# Altium project Transceiver_Project.PrjPCB
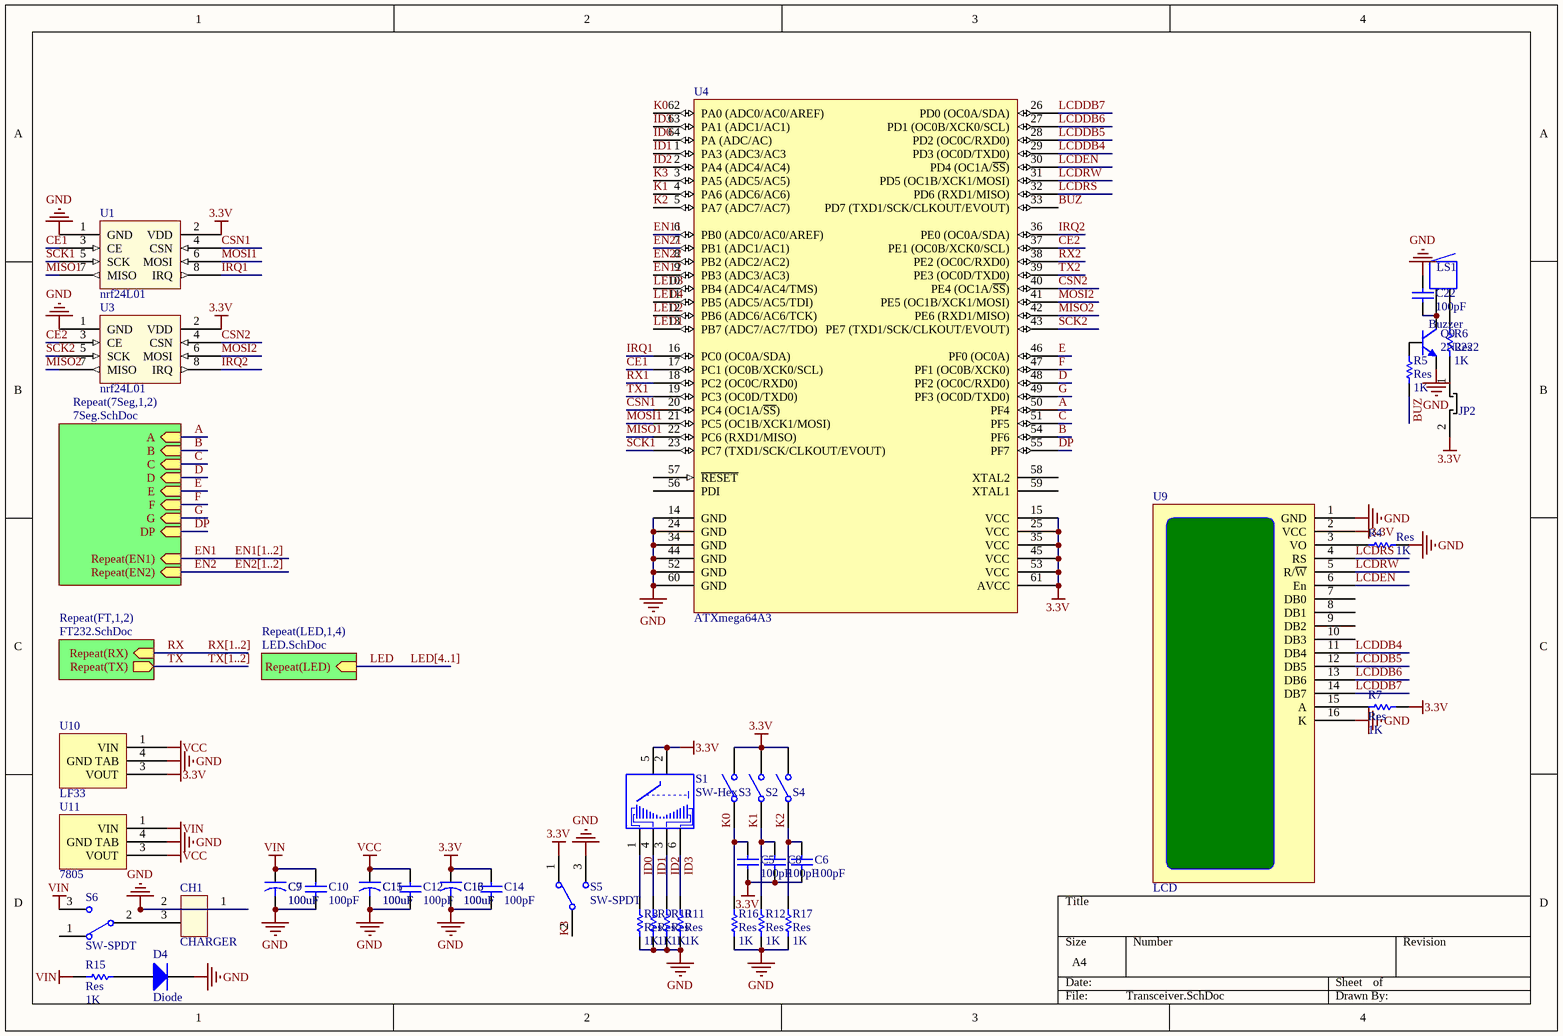
[diagram p0: Transceiver.SchDoc]
3 sheets, 74 parts. Net scope: hierarchical (ports join the sheet entries above them; power ports are global).
Board file: Transceiver.PcbDoc
Sheets:
  Transceiver.SchDoc
    FT1 = FT232.SchDoc
    FT2 = FT232.SchDoc
    7Seg1 = 7Seg.SchDoc
    7Seg2 = 7Seg.SchDoc

## Sheet Transceiver.SchDoc
size A4

### Parts
C5  value 100pF  [2012[0805]]  (hidden comment: Cap_UP)
C6  value 100pF  [2012[0805]]  (hidden comment: Cap_UP)
C7  value 100uF  [EL_M]  (hidden comment: Cap_El)
C8  value 100pF  [2012[0805]]  (hidden comment: Cap_UP)
C9  value 100uF  [EL_M]  (hidden comment: Cap_El)
C10  value 100pF  [2012[0805]]  (hidden comment: Cap_UP)
C11  value 100uF  [EL_M]  (hidden comment: Cap_El)
C12  value 100pF  [2012[0805]]  (hidden comment: Cap_UP)
C13  value 100uF  [EL_M]  (hidden comment: Cap_El)
C14  value 100pF  [2012[0805]]  (hidden comment: Cap_UP)
C15  value 100uF  [EL_M]  (hidden comment: Cap_El)
C16  value 100uF  [EL_M]  (hidden comment: Cap_El)
C22  value 100pF  [2012[0805]]  (hidden comment: Cap_UP)
CH1  CHARGER  [CHARGER]
D4  Diode  [2012[0805]]
JP2  JUMPER  [HDR1X2]  (value not drawn)
LS1  Buzzer  [BUZZER]
Q9  2N2222  [SOT-23]
R4  Res  value 1K  [2012[0805]]
R5  Res  value 1K  [2012[0805]]
R6  Res  value 1K  [2012[0805]]
R7  Res  value 1K  [2012[0805]]
R8  Res  value 1K  [2012[0805]]
R9  Res  value 1K  [2012[0805]]
R10  Res  value 1K  [2012[0805]]
R11  Res  value 1K  [2012[0805]]
R12  Res  value 1K  [2012[0805]]
R15  Res  value 1K  [2012[0805]]
R16  Res  value 1K  [2012[0805]]
R17  Res  value 1K  [2012[0805]]
S1  SW-Hex  [SW-HEX]
S2  SW-SPST  [PUSH-BUT-SMD]  (value not drawn)
S3  SW-SPST  [PUSH-BUT]  (value not drawn)
S4  SW-SPST  [PUSH-BUT]  (value not drawn)
S5  SW-SPDT  [SW-SPDT]
S6  SW-SPDT  [SW-SPDT]
U1  nrf24L01  [NRF24L01+PA+LNA]
U3  nrf24L01  [NRF24L01+PA+LNA]
U4  ATXmega64A3  [64A_N]
U9  LCD  [LCD]
U10  LF33  [D-PACK]
U11  7805  [D-PACK]

### Sub-sheets
Repeat(7Seg,1,2) = 7Seg.SchDoc: A (in), B (in), C (in), D (in), E (in), F (in), G (in), DP (in), Repeat(EN1) (in), Repeat(EN2) (in)
Repeat(FT,1,2) = FT232.SchDoc: Repeat(RX) (in), Repeat(TX) (out)
Repeat(LED,1,4) = LED.SchDoc (file not in this document): Repeat(LED) (in)

### Nets
3.3V: C5.2 C6.2 C8.2 C13.1 C14.2 C16.1 JP2.2 R7.2 S1.2 S1.5 S2.2(NO) S3.2(NO) S4.2(NO) S5.1 U1.2(VDD) U3.2(VDD) U4.15(VCC) U4.25(VCC) U4.35(VCC) U4.45(VCC) U4.53(VCC) U4.61(AVCC) U9.2(VCC) U10.3(VOUT)
GND: C7.2 C9.2 C10.1 C11.2 C12.1 C13.2 C14.1 C15.2 C16.2 C22.2 CH1.1 CH1.2 D4.2(K) Q9.3(E) R4.2 R8.1 R9.1 R10.1 R11.1 R12.1 R16.1 R17.1 S5.3 U1.1(GND) U3.1(GND) U4.14(GND) U4.24(GND) U4.34(GND) U4.44(GND) U4.52(GND) U4.60(GND) U9.1(GND) U9.16(K) U10.4(GND_TAB) U11.4(GND_TAB)
VCC: C11.1 C12.2 C15.1 U10.1(VIN) U11.3(VOUT)
VIN: C7.1 C9.1 C10.2 R15.1 S6.3 U11.1(VIN)
A: U4.50(PF4) ; sheet Repeat(7Seg,1,2)/A
B: U4.54(PF6) ; sheet Repeat(7Seg,1,2)/B
BUZ: R5.2 U4.33(PD7_(TXD1/SCK/CLKOUT/EVOUT))
C: U4.51(PF5) ; sheet Repeat(7Seg,1,2)/C
CE1: U1.3(CE) U4.17(PC1_(OC0B/XCK0/SCL))
CE2: U3.3(CE) U4.37(PE1_(OC0B/XCK0/SCL))
CSN1: U1.4(CSN) U4.20(PC4_(OC1A/~{SS}))
CSN2: U3.4(CSN) U4.40(PE4_(OC1A/~{SS}))
D: U4.48(PF2_(OC0C/RXD0)) ; sheet Repeat(7Seg,1,2)/D
DP: U4.55(PF7) ; sheet Repeat(7Seg,1,2)/DP
E: U4.46(PF0_(OC0A)) ; sheet Repeat(7Seg,1,2)/E
EN1: sheet Repeat(7Seg,1,2)/Repeat(EN1)
EN2: sheet Repeat(7Seg,1,2)/Repeat(EN2)
EN11: U4.6(PB0_(ADC0/AC0/AREF))  [project net EN1]
EN12: U4.9(PB3_(ADC3/AC3))  [project net EN1]
EN21: U4.7(PB1_(ADC1/AC1))  [project net EN2]
EN22: U4.8(PB2_(ADC2/AC2))  [project net EN2]
F: U4.47(PF1_(OC0B/XCK0)) ; sheet Repeat(7Seg,1,2)/F
G: U4.49(PF3_(OC0D/TXD0)) ; sheet Repeat(7Seg,1,2)/G
ID0: R8.2 S1.1 U4.64(PA_(ADC/AC))
ID1: R9.2 S1.4 U4.1(PA3_(ADC3/AC3)
ID2: R10.2 S1.3 U4.2(PA4_(ADC4/AC4))
ID3: R11.2 S1.6 U4.63(PA1_(ADC1/AC1))
IRQ1: U1.8(IRQ) U4.16(PC0_(OC0A/SDA))
IRQ2: U3.8(IRQ) U4.36(PE0_(OC0A/SDA))
K0: C5.1 R16.2 S3.1(COMMON) U4.62(PA0_(ADC0/AC0/AREF))
K1: C8.1 R12.2 S2.1(COMMON) U4.4(PA6_(ADC6/AC6))
K2: C6.1 R17.2 S4.1(COMMON) U4.5(PA7_(ADC7/AC7))
K3: S5.2 U4.3(PA5_(ADC5/AC5))
LCDDB4: U4.29(PD3_(OC0D/TXD0)) U9.11(DB4)
LCDDB5: U4.28(PD2_(OC0C/RXD0)) U9.12(DB5)
LCDDB6: U4.27(PD1_(OC0B/XCK0/SCL)) U9.13(DB6)
LCDDB7: U4.26(PD0_(OC0A/SDA)) U9.14(DB7)
LCDEN: U4.30(PD4_(OC1A/~{SS})) U9.6(En)
LCDRS: U4.32(PD6_(RXD1/MISO)) U9.4(RS)
LCDRW: U4.31(PD5_(OC1B/XCK1/MOSI)) U9.5(R/~{W})
LED: sheet Repeat(LED,1,4)/Repeat(LED)
LED1: U4.13(PB7_(ADC7/AC7/TDO))
LED2: U4.12(PB6_(ADC6/AC6/TCK))
LED3: U4.10(PB4_(ADC4/AC4/TMS))
LED4: U4.11(PB5_(ADC5/AC5/TDI))
MISO1: U1.7(MISO) U4.22(PC6_(RXD1/MISO))
MISO2: U3.7(MISO) U4.42(PE6_(RXD1/MISO))
MOSI1: U1.6(MOSI) U4.21(PC5_(OC1B/XCK1/MOSI))
MOSI2: U3.6(MOSI) U4.41(PE5_(OC1B/XCK1/MOSI))
RX: sheet Repeat(FT,1,2)/Repeat(RX)
RX1: U4.18(PC2_(OC0C/RXD0))
RX2: U4.38(PE2_(OC0C/RXD0))
SCK1: U1.5(SCK) U4.23(PC7_(TXD1/SCK/CLKOUT/EVOUT))
SCK2: U3.5(SCK) U4.43(PE7_(TXD1/SCK/CLKOUT/EVOUT))
TX: sheet Repeat(FT,1,2)/Repeat(TX)
TX1: U4.19(PC3_(OC0D/TXD0))
TX2: U4.39(PE3_(OC0D/TXD0))
NetC22_1: C22.1 LS1.1 Q9.1(C)
NetCH1_3: CH1.3 S6.2
NetD4_1: D4.1(A) R15.2
NetJP2_1: JP2.1 R6.2
NetLS1_2: LS1.2 R6.1
NetQ9_2: Q9.2(B) R5.1
NetR4_1: R4.1 U9.3(VO)
NetR7_1: R7.1 U9.15(A)

Not connected (* = marked no-connect by the designer): S6 1(3); U4 56(PDI) 57(~{RESET}) 58(XTAL2) 59(XTAL1); U9 7(DB0) 8(DB1) 9(DB2) 10(DB3)

### Buses and harness runs
bus EN1[1..2]
bus EN2[1..2]
bus LED[4..1]
bus RX[1..2]
bus TX[1..2]

### Library data of the parts
C5 C6 C8 C10 C12 C14 C22 = Cap_UP: Capacitor; Published: 8-Jun-2000; LatestRevisionDate: 17-Jul-2002; LatestRevisionNote: Re-released for DXP Platform.; PackageReference: RAD-0.3; Publisher: Altium Limited
C7 C9 C11 C13 C15 C16 = Cap_El: Capacitor; Published: 23-Sep-2002; PackageReference: CAPR5-4X5; Publisher: Altium Limited
D4 = Diode: 1 Amp General Purpose Rectifier; Revision 1: 11-Jul-2000: SIM Model Added.; Revision 2: 17-Jul-2002: Re-released for DXP Platform.; Package Information: Latest Revision: Aug-1999; Code - JEDEC: DO-204-AL; Published: 8-Jun-2000; Datasheet: Latest Revision: 1998; Package Reference: DO-41; Publisher: Altium Limited
LS1 = Buzzer: Magnetic Transducer Buzzer; Published: 24-Mar-1999; LatestRevisionDate: 17-Dec-2003; LatestRevisionNote: Schematic revised, PCB Footprint replaced.; DatasheetDocument: 17-Dec-2003; PackageReference: ABSM-1574; Publisher: Altium Limited; ComponentLink1Description: Manufacturer Link; ComponentLink1URL: http://www.megastar.com/linecard/buzzmode/index.php
Q9 = 2N2222: NPN Bipolar Transistor; Published: 8-Jun-2000; LatestRevisionDate: 17-Jul-2002; LatestRevisionNote: Re-released for DXP Platform.; PackageReference: TO-226; Publisher: Altium Limited; Code_JEDEC: TO-226-AA
R4-R12 R15-R17 = Res: Semiconductor Resistor; Published: 8-Jun-2000; LatestRevisionDate: 17-Jul-2002; LatestRevisionNote: Re-released for DXP Platform.; PackageReference: AXIAL-0.5; Publisher: Altium Limited
S2-S4 = SW-SPST: Single-Pole, Single-Throw Switch; Published: 24-Mar-1999; Revision: July-2002: Re-released for DXP Platform.; Publisher: Altium Limited
S5 S6 = SW-SPDT: SPDT Subminiature Toggle Switch, Right Angle Mounting, Vertical Actuation; Published: 24-Mar-1999; LatestRevisionDate: 17-Dec-2003; LatestRevisionNote: Schematic revised, PCB Footprint replaced.; DatasheetDocument: 05-Dec-2000; PackageReference: TL36WW15050; Publisher: Altium Limited; ComponentLink1Description: Manufacturer Link; ComponentLink1URL: http://www.apem.com
U9 = LCD: LCD 2X16
U10 = 7805
S1 = SW-Hex: Published: 24-Mar-1999; LatestRevisionDate: 17-Jul-2002; LatestRevisionNote: Re-released for DXP Platform.; PackageReference: DIP-8; Publisher: Altium Limited

## Sheet FT232.SchDoc
size A4
Used 2 times, as channels FT1, FT2. Parts and nets are listed once, with the designators drawn on the sheet.
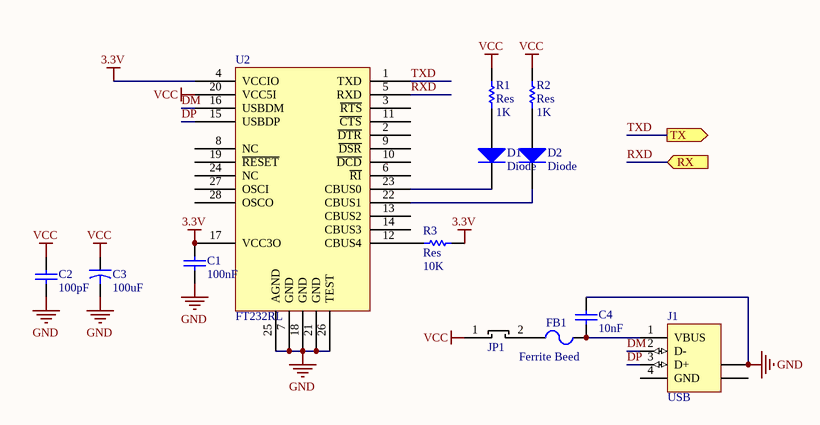
[diagram p1: FT232.SchDoc]

### Parts
C1  value 100nF  [2012[0805]]  (hidden comment: Cap_UP)
C2  value 100pF  [2012[0805]]  (hidden comment: Cap_UP)
C3  value 100uF  [2012[0805]]  (hidden comment: Cap_El)
C4  value 10nF  [2012[0805]]  (hidden comment: Cap_UP)
D1  Diode  [2012[0805]]
D2  Diode  [2012[0805]]
FB1  Ferrite Beed  [2012[0805]]
J1  USB  [USB_MINI]
JP1  JUMPER  [HDR1X2]  (value not drawn)
R1  Res  value 1K  [2012[0805]]
R2  Res  value 1K  [2012[0805]]
R3  Res  value 10K  [2012[0805]]
U2  FT232RL  [SSOP28]

### Ports
RX (in), TX (out)

### Nets
3.3V: C1.2 R3.2 U2.4(VCCIO) U2.17(VCC3O)
GND: C1.1 C2.1 C3.2 C4.1 J1.5(SHLD) U2.7(GND) U2.18(GND) U2.21(GND) U2.25(AGND) U2.26(TEST)
VCC: C2.2 C3.1 JP1.1 R1.2 R2.2 U2.20(VCC5I)
DM: J1.2(D-) U2.16(USBDM)
DP: J1.3(D+) U2.15(USBDP)
RXD: U2.5(RXD) ; port RX
TXD: U2.1(TXD) ; port TX
NetC4_2: C4.2 FB1.2 J1.1(VBUS)
NetD1_1: D1.1(A) R1.1
NetD1_2: D1.2(K) U2.23(CBUS0)
NetD2_1: D2.1(A) R2.1
NetD2_2: D2.2(K) U2.22(CBUS1)
NetFB1_1: FB1.1 JP1.2
NetR3_1: R3.1 U2.12(CBUS4)

Not connected (* = marked no-connect by the designer): J1 4(GND) 6(SHLD); U2 2(~{DTR}) 3(~{RTS}) 6(~{RI}) 8(NC) 9(~{DSR}) 10(~{DCD}) 11(~{CTS}) 13(CBUS2) 14(CBUS3) 19(~{RESET}) 24(NC) 27(OSCI) 28(OSCO)

### Channels
FT1: designators end in _FT1; ports RX=RX1 TX=TX1
FT2: designators end in _FT2; ports RX=RX2 TX=TX2

### Library data of the parts
C1 C2 C4 = Cap_UP: Capacitor; Published: 8-Jun-2000; LatestRevisionDate: 17-Jul-2002; LatestRevisionNote: Re-released for DXP Platform.; PackageReference: RAD-0.3; Publisher: Altium Limited
C3 = Cap_El: Capacitor; Published: 23-Sep-2002; PackageReference: CAPR5-4X5; Publisher: Altium Limited
D1 D2 = Diode: as D4 on sheet Transceiver; Published: 8-Jun-2000; Datasheet: Latest Revision: 1998; Package Reference: DO-41; Publisher: Altium Limited
FB1 = Ferrite Beed: Code_IEC: 1005; Published: 8-Jun-2000; LatestRevisionDate: 17-Jul-2002; LatestRevisionNote: Re-released for DXP Platform.; PackageReference: 0402-A; Publisher: Altium Limited; Code_JEITA: 0402
J1 = USB: USB 1.1, Right Angle, Thru-Hole, A Type, Receptacle, 4 Position, Black; ContactMaterial: Copper Alloy; ContactPlating: Gold (30) over Palladium Nickel; TerminationLength: 2.84mm [0.112in.]; PCB_Layout: Complies with manufacturer's recommendation.; DrillSize: Corresponds to nominal value.; PanelGround: Without; Published: 15-Jul-2004; DatasheetDocument: 11-Jan-2004; PackageDocument: 11-Jan-2004; PackageReference: 1364372; Publisher: Altium Limited; HousingMaterial: Thermoplastic; ComponentLink1Description: Manufacturer Link; ComponentLink1URL: http://www.tycoelectronics.com/; ComponentLink2Description: Packaging Specification; ComponentLink2URL: http://ecommas.tycoelectronics.com/commerce/DocumentDelivery/DDEController?Action=showdoc&DocId=Customer+Drawing%7F1364372%7FD%7Ftif%7FEnglish%7FENG_CD_1364372_D.tif
R1-R3 = Res: Semiconductor Resistor; Published: 8-Jun-2000; LatestRevisionDate: 17-Jul-2002; LatestRevisionNote: Re-released for DXP Platform.; PackageReference: AXIAL-0.5; Publisher: Altium Limited

## Sheet 7Seg.SchDoc
size A4
Used 2 times, as channels 7Seg1, 7Seg2. Parts and nets are listed once, with the designators drawn on the sheet.
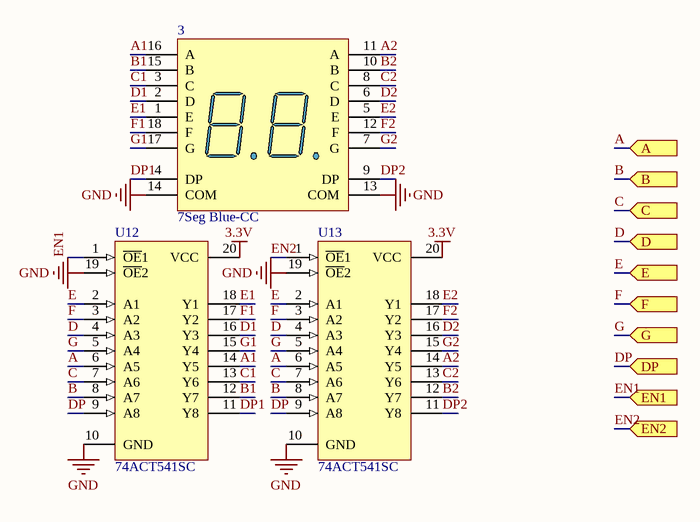
[diagram p2: 7Seg.SchDoc]

### Parts
3  7Seg Blue-CC  [7Segment Dual]
U12  74ACT541SC  [M20B_N]
U13  74ACT541SC  [M20B_N]

### Ports
A (in), B (in), C (in), D (in), DP (in), E (in), EN1 (in), EN2 (in), F (in), G (in)

### Nets
3.3V: U12.20(VCC) U13.20(VCC)
GND: 3.13(COM) 3.14(COM) U12.10(GND) U12.19(~{OE}2) U13.10(GND) U13.19(~{OE}2)
A: U12.6(A5) U13.6(A5) ; port A
A1: 3.16(A) U12.14(Y5)
A2: 3.11(A) U13.14(Y5)
B: U12.8(A7) U13.8(A7) ; port B
B1: 3.15(B) U12.12(Y7)
B2: 3.10(B) U13.12(Y7)
C: U12.7(A6) U13.7(A6) ; port C
C1: 3.3(C) U12.13(Y6)
C2: 3.8(C) U13.13(Y6)
D: U12.4(A3) U13.4(A3) ; port D
D1: 3.2(D) U12.16(Y3)
D2: 3.6(D) U13.16(Y3)
DP: U12.9(A8) U13.9(A8) ; port DP
DP1: 3.4(DP) U12.11(Y8)
DP2: 3.9(DP) U13.11(Y8)
E: U12.2(A1) U13.2(A1) ; port E
E1: 3.1(E) U12.18(Y1)
E2: 3.5(E) U13.18(Y1)
EN1: U12.1(~{OE}1) ; port EN1
EN2: U13.1(~{OE}1) ; port EN2
F: U12.3(A2) U13.3(A2) ; port F
F1: 3.18(F) U12.17(Y2)
F2: 3.12(F) U13.17(Y2)
G: U12.5(A4) U13.5(A4) ; port G
G1: 3.17(G) U12.15(Y4)
G2: 3.7(G) U13.15(Y4)

### Channels
7Seg1: designators end in _7Seg1; ports A=A B=B C=C D=D DP=DP E=E EN1=EN1 EN2=EN2 F=F G=G
7Seg2: designators end in _7Seg2; ports A=A B=B C=C D=D DP=DP E=E EN1=EN1 EN2=EN2 F=F G=G

### Library data of the parts
3 = 7Seg Blue-CC_Dual: General Purpose Blue 7-Segment Display: CC, RH DP, Gray Surface; MinimumIntensity: 2020 ucd; Note: IF = 10 mA; Published: 8-Jun-2000; LatestRevisionDate: 17-Dec-2003; LatestRevisionNote: Schematic revised, PCB Footprint replaced.; DatasheetDocument: 24-Sep-2002; PackageDocument: 24-Sep-2002; PackageReference: H; Publisher: Altium Limited; Colour: Blue; ComponentLink1Description: Manufacturer Link; ComponentLink1URL: http://www.agilent.com/
U12 U13 = 74ACT541SC: Octal Buffer/Line Driver with 3-State Output; Published: 17-Jul-2002; LatestRevisionDate: 13-Apr-2006; LatestRevisionNote: IPC-7351 Footprint Added.; DatasheetVersion: Oct-1999; PackageVersion: 2000; PackageReference: M20B; Publisher: Altium Limited; PackageDescription: 20-Pin Small Outline Integrated Circuit 1.27 mm Pitch; Code_JEDEC: MS-013-AC; Code_IPC: SOIC127P1030-20; ComponentLink1Description: Manufacturer Link; ComponentLink1URL: http://www.fairchildsemi.com/; ComponentLink2Description: Datasheet; ComponentLink2URL: http://www.fairchildsemi.com/ds/74%2F74AC541.pdf

## Nets that join several sheets
3.3V: Transceiver (24 pins), FT1 (C1_FT1.2 R3_FT1.2 U2_FT1.4 U2_FT1.17), FT2 (C1_FT2.2 R3_FT2.2 U2_FT2.4 U2_FT2.17), 7Seg1 (U12_7Seg1.20 U13_7Seg1.20), 7Seg2 (U12_7Seg2.20 U13_7Seg2.20)
GND: Transceiver (35 pins), FT1 (10 pins), FT2 (10 pins), 7Seg1 (6 pins), 7Seg2 (6 pins)
VCC: Transceiver (5 pins), FT1 (6 pins), FT2 (6 pins)
A: Transceiver (U4.50), 7Seg1 (U12_7Seg1.6 U13_7Seg1.6), 7Seg2 (U12_7Seg2.6 U13_7Seg2.6)
B: Transceiver (U4.54), 7Seg1 (U12_7Seg1.8 U13_7Seg1.8), 7Seg2 (U12_7Seg2.8 U13_7Seg2.8)
C: Transceiver (U4.51), 7Seg1 (U12_7Seg1.7 U13_7Seg1.7), 7Seg2 (U12_7Seg2.7 U13_7Seg2.7)
D: Transceiver (U4.48), 7Seg1 (U12_7Seg1.4 U13_7Seg1.4), 7Seg2 (U12_7Seg2.4 U13_7Seg2.4)
DP: Transceiver (U4.55), 7Seg1 (U12_7Seg1.9 U13_7Seg1.9), 7Seg2 (U12_7Seg2.9 U13_7Seg2.9)
E: Transceiver (U4.46), 7Seg1 (U12_7Seg1.2 U13_7Seg1.2), 7Seg2 (U12_7Seg2.2 U13_7Seg2.2)
EN1: Transceiver (U4.6), 7Seg1 (U12_7Seg1.1)
EN1: Transceiver (U4.9), 7Seg2 (U12_7Seg2.1)
EN2: Transceiver (U4.7), 7Seg1 (U13_7Seg1.1)
EN2: Transceiver (U4.8), 7Seg2 (U13_7Seg2.1)
F: Transceiver (U4.47), 7Seg1 (U12_7Seg1.3 U13_7Seg1.3), 7Seg2 (U12_7Seg2.3 U13_7Seg2.3)
G: Transceiver (U4.49), 7Seg1 (U12_7Seg1.5 U13_7Seg1.5), 7Seg2 (U12_7Seg2.5 U13_7Seg2.5)
RX1: Transceiver (U4.18), FT1 (U2_FT1.5)
RX2: Transceiver (U4.38), FT2 (U2_FT2.5)
TX1: Transceiver (U4.19), FT1 (U2_FT1.1)
TX2: Transceiver (U4.39), FT2 (U2_FT2.1)